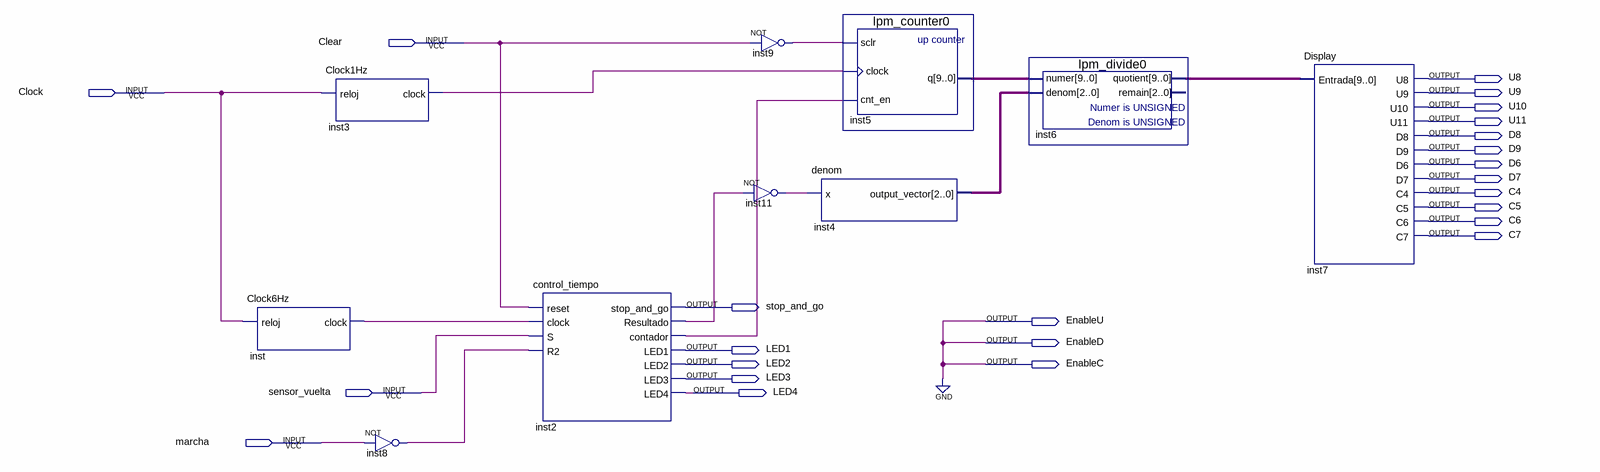
[diagram p0: schematic sheet]
// Quartus schematic Subgrupo-A.bdf as structural Verilog: 10 symbols, 24 pins
module \Subgrupo-A  (
  input  Clear,
  input  Clock,
  input  sensor_vuelta,
  input  marcha,
  output U8,
  output U9,
  output U10,
  output U11,
  output D8,
  output D9,
  output D6,
  output D7,
  output C4,
  output C5,
  output C6,
  output C7,
  output stop_and_go,
  output EnableU,
  output EnableD,
  output LED1,
  output LED2,
  output EnableC,
  output LED3,
  output LED4
);

  wire inst2_contador, inst2_resultado, inst3_clock, inst8_out, inst9_out, inst11_out, inst_clock;
  wire [2:0] inst4_output_vector;
  wire [9:0] inst5_q, inst6_quotient;

  Clock6Hz inst (.reloj(Clock), .clock(inst_clock));
  Clock1Hz inst3 (.reloj(Clock), .clock(inst3_clock));
  not inst8 (inst8_out, marcha);
  control_tiempo inst2 (
    .reset(Clear), .clock(inst_clock), .S(sensor_vuelta), .R2(inst8_out), .stop_and_go(stop_and_go),
    .Resultado(inst2_resultado), .contador(inst2_contador), .LED1(LED1), .LED2(LED2), .LED3(LED3), .LED4(LED4));
  not inst11 (inst11_out, inst2_resultado);
  not inst9 (inst9_out, Clear);
  lpm_counter0 inst5 (.sclr(inst9_out), .clock(inst3_clock), .cnt_en(inst2_contador), .q(inst5_q));
  denom inst4 (.x(inst11_out), .output_vector(inst4_output_vector));
  lpm_divide0 inst6 (.numer(inst5_q), .denom(inst4_output_vector), .quotient(inst6_quotient));  // open: remain
  Display inst7 (
    .Entrada(inst6_quotient), .U8(U8), .U9(U9), .U10(U10), .U11(U11), .D8(D8), .D9(D9), .D6(D6), .D7(D7),
    .C4(C4), .C5(C5), .C6(C6), .C7(C7));

  assign EnableC = 1'b0;
  assign EnableD = 1'b0;
  assign EnableU = 1'b0;
endmodule
